# EAGLE schematic dlp.vco.dualosc.v1.0 (EAGLE 7.2.0)
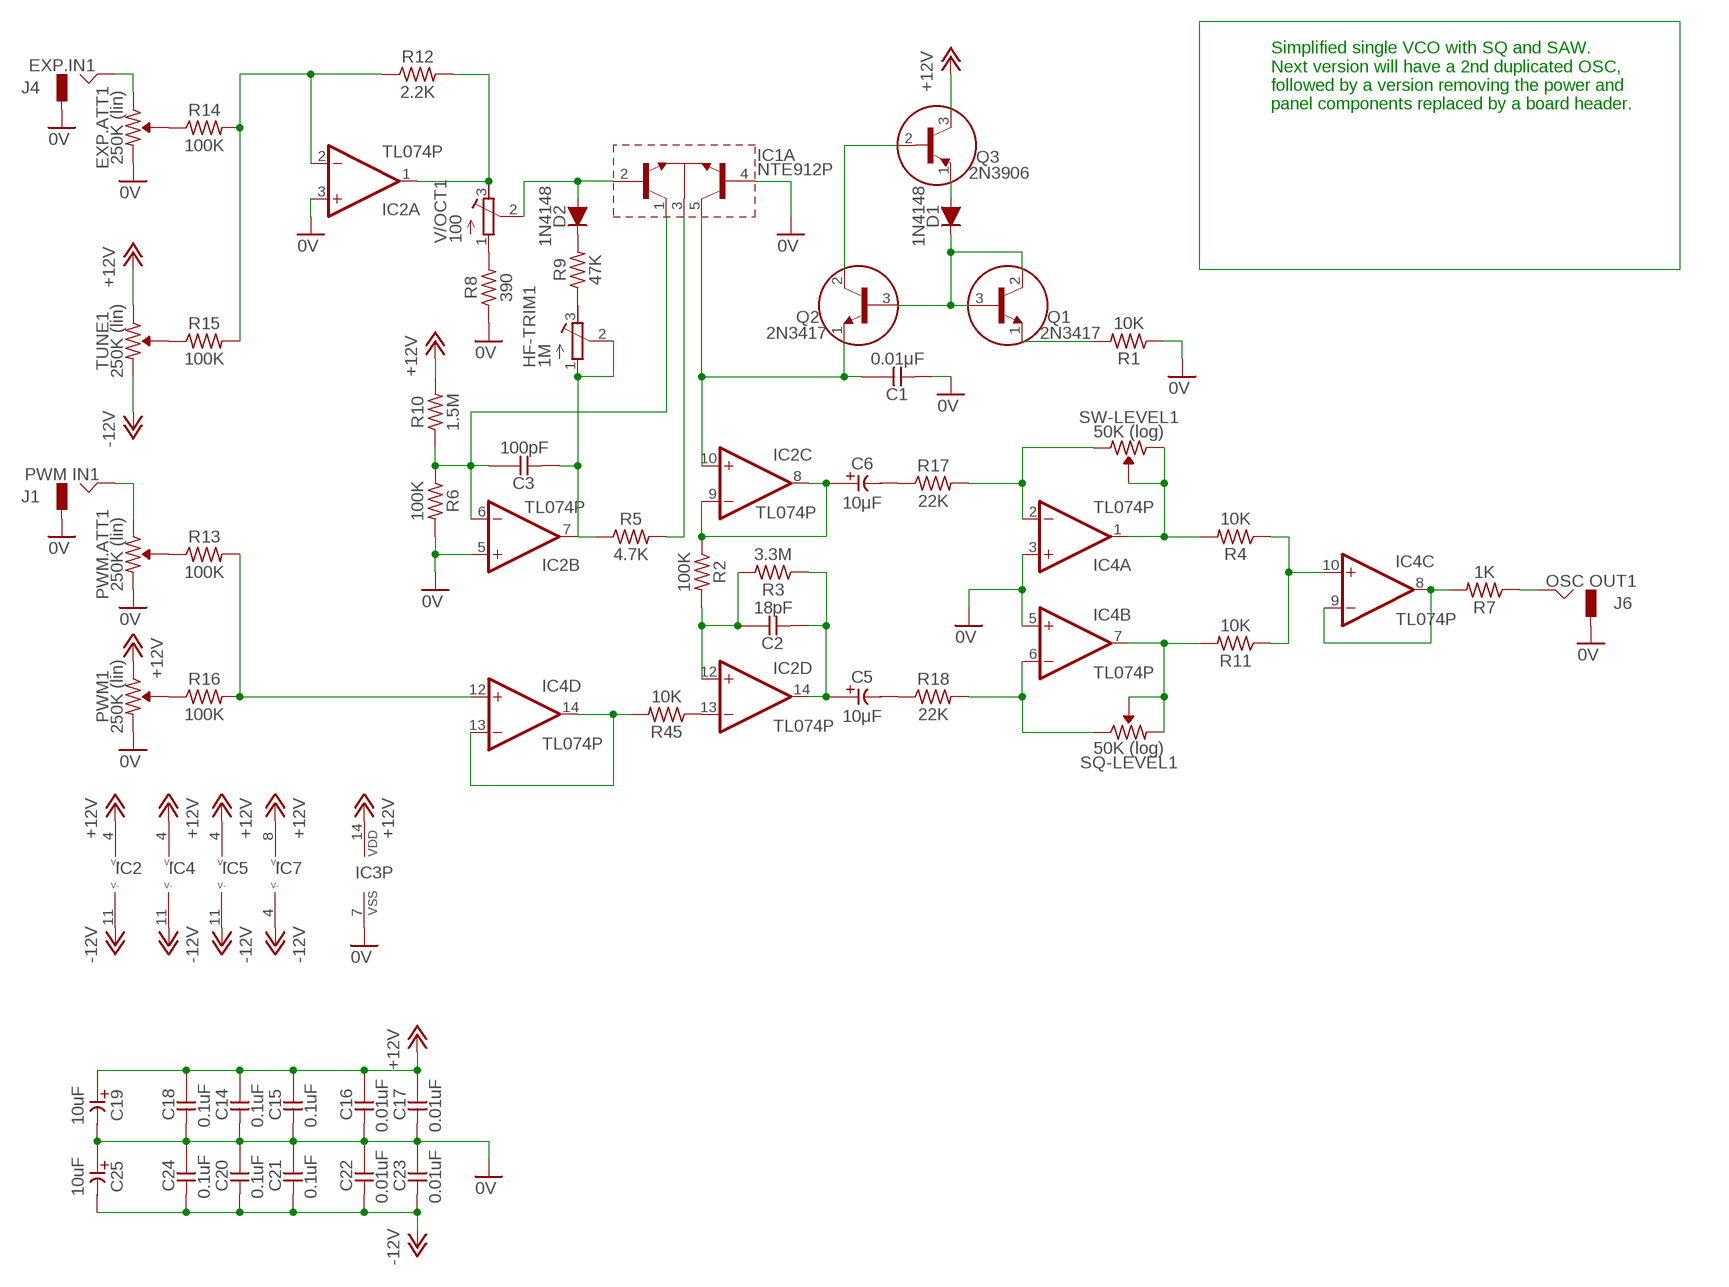
[diagram p0: schematic, sheet 1]

## Parts
C1  0.01μF  CC-US025-024X044  [C025-024X044]
C2  18pF  CC-US025-024X044  [C025-024X044]
C3  100pF  CC-US025-024X044  [C025-024X044]
C5  10μF  CE-USE2-5  [E2-5]
C6  10μF  CE-USE2-5  [E2-5]
C14  0.1uF  CC-US025-024X044  [C025-024X044]
C15  0.1uF  CC-US025-024X044  [C025-024X044]
C16  0.01uF  CC-US025-024X044  [C025-024X044]
C17  0.01uF  CC-US025-024X044  [C025-024X044]
C18  0.1uF  CC-US025-024X044  [C025-024X044]
C19  10uF  CE-USE2-5  [E2-5]
C20  0.1uF  CC-US025-024X044  [C025-024X044]
C21  0.1uF  CC-US025-024X044  [C025-024X044]
C22  0.01uF  CC-US025-024X044  [C025-024X044]
C23  0.01uF  CC-US025-024X044  [C025-024X044]
C24  0.1uF  CC-US025-024X044  [C025-024X044]
C25  10uF  CE-USE2-5  [E2-5]
D1  1N4148  [DO35-7]
D2  1N4148  [DO35-7]
EXP.ATT1  250K (lin)  R-VAR  [R-VAR]
HF-TRIM1  1M  R-TRIMM3296Y  [RTRIM3296Y]
IC1  NTE912P  [DIL14]
IC2  TL074P  [DIL14]
IC3  4013N  [DIL14]
IC4  TL074P  [DIL14]
IC5  TL074P  [DIL14]
IC7  TL072P  [DIL08]
J1  PWM IN1  JACK-M  [JACK-M]
J4  EXP.IN1  JACK-M  [JACK-M]
J6  OSC OUT1  JACK-M  [JACK-M]
PWM1  250K (lin)  R-VAR  [R-VAR]
PWM.ATT1  250K (lin)  R-VAR  [R-VAR]
Q1  2N3417  [TO92]
Q2  2N3417  [TO92]
Q3  2N3906  [TO92]
R1  10K  R0309/10  [0309/10]
R2  100K  R0309/10  [0309/10]
R3  3.3M  R0309/10  [0309/10]
R4  10K  R0309/10  [0309/10]
R5  4.7K  R0309/10  [0309/10]
R6  100K  R0309/10  [0309/10]
R7  1K  R0309/10  [0309/10]
R8  390  R0309/10  [0309/10]
R9  47K  R0309/10  [0309/10]
R10  1.5M  R0309/10  [0309/10]
R11  10K  R0309/10  [0309/10]
R12  2.2K  R0309/10  [0309/10]
R13  100K  R0309/10  [0309/10]
R14  100K  R0309/10  [0309/10]
R15  100K  R0309/10  [0309/10]
R16  100K  R0309/10  [0309/10]
R17  22K  R0309/10  [0309/10]
R18  22K  R0309/10  [0309/10]
R45  10K  R0309/10  [0309/10]
SQ-LEVEL1  50K (log)  R-VAR  [R-VAR]
SW-LEVEL1  50K (log)  R-VAR  [R-VAR]
TUNE1  250K (lin)  R-VAR  [R-VAR]
V/OCT1  100  R-TRIMM3296Y  [RTRIM3296Y]

## Nets
0V: C1.2 C14.2 C15.2 C16.2 C17.2 C18.2 C19.- C20.1 C21.1 C22.1 C23.1 C24.1 C25.+ EXP.ATT1.R2 IC1.4(A:B3) IC2.3(A:+IN) IC2.5(B:+IN) IC3.7(P:VSS) IC4.3(A:+IN) IC4.5(B:+IN) J1.GND J4.GND J6.GND PWM1.R2 PWM.ATT1.R2 R1.1 R6.2 R8.1
+12V: C14.1 C15.1 C16.1 C17.1 C18.1 C19.+ IC2.4(P:V+) IC3.14(P:VDD) IC4.4(P:V+) IC5.4(P:V+) IC7.8(P:V+) PWM1.R1 Q3.3(C) R10.2 TUNE1.R1
-12V: C20.2 C21.2 C22.2 C23.2 C24.2 C25.- IC2.11(P:V-) IC4.11(P:V-) IC5.11(P:V-) IC7.4(P:V-) TUNE1.R2
N$1: C1.1 IC1.5(A:C3) IC2.10(C:+IN) Q2.1(E)
N$2: Q2.2(C) Q3.2(B)
N$3: D1.A Q3.1(E)
N$4: C6.+ IC2.8(C:OUT) IC2.9(C:-IN) R2.1
N$5: D1.C Q1.2(C) Q1.3(B) Q2.3(B)
N$6: Q1.1(E) R1.2
N$7: C2.1 IC2.12(D:+IN) R2.2 R3.2
N$8: IC2.13(D:-IN) R45.1
N$9: C2.2 C5.+ IC2.14(D:OUT) R3.1
N$10: PWM.ATT1.VAR R13.1
N$11: D2.A IC1.2(A:B1) V/OCT1.2(S)
N$12: IC1.3(A:E) R5.2
N$13: D2.C R9.2
N$14: R8.2 V/OCT1.1(A)
N$15: C3.1 IC1.1(A:C1) IC2.6(B:-IN) R6.1 R10.1
N$16: IC2.1(A:OUT) R12.2 V/OCT1.3(E)
N$17: HF-TRIM1.3(E) R9.1
N$18: IC4.10(C:+IN) R4.1 R11.1
N$19: PWM1.VAR R16.1
N$20: IC4.8(C:OUT) IC4.9(C:-IN) R7.2
N$21: J6.HOT R7.1
N$22: IC4.2(A:-IN) R17.2 SW-LEVEL1.R2
N$23: EXP.ATT1.VAR R14.1
N$24: R15.1 TUNE1.VAR
N$25: J1.HOT PWM.ATT1.R1
N$26: EXP.ATT1.R1 J4.HOT
N$27: IC4.13(D:-IN) IC4.14(D:OUT) R45.2
N$28: IC2.2(A:-IN) R12.1 R14.2 R15.2
N$29: C6.- R17.1
N$30: C5.- R18.1
N$31: IC4.1(A:OUT) R4.2 SW-LEVEL1.R1 SW-LEVEL1.VAR
N$32: IC4.7(B:OUT) R11.2 SQ-LEVEL1.R2 SQ-LEVEL1.VAR
N$34: IC4.6(B:-IN) R18.2 SQ-LEVEL1.R1
N$35: IC4.12(D:+IN) R13.2 R16.2
N$37: C3.2 HF-TRIM1.1(A) HF-TRIM1.2(S) IC2.7(B:OUT) R5.1
Unconnected: IC1.6(B:B) IC1.7(B:E) IC1.8(B:C) IC1.9(C:B) IC1.10(C:E) IC1.11(C:C) IC1.12(D:B) IC1.13(D:E) IC1.14(D:C) IC3.1(A:Q) IC3.2(A:!Q) IC3.3(A:CLK) IC3.4(A:R) IC3.5(A:D) IC3.6(A:S) IC3.8(B:S) IC3.9(B:D) IC3.10(B:R) IC3.11(B:CLK) IC3.12(B:!Q) IC3.13(B:Q) IC5.1(A:OUT) IC5.2(A:-IN) IC5.3(A:+IN) IC5.5(B:+IN) IC5.6(B:-IN) IC5.7(B:OUT) IC5.8(C:OUT) IC5.9(C:-IN) IC5.10(C:+IN) IC5.12(D:+IN) IC5.13(D:-IN) IC5.14(D:OUT) IC7.1(A:OUT) IC7.2(A:-IN) IC7.3(A:+IN) IC7.5(B:+IN) IC7.6(B:-IN) IC7.7(B:OUT)

## Notes on the sheet
- Simplified single VCO with SQ and SAW.
  Next version will have a 2nd duplicated OSC,
  followed by a version removing the power and 
  panel components replaced by a board header.
- IC2 | IC4 | IC5 | IC7

## Library data of the parts
C1-C3 C14-C18 C20-C24 = _common:CC-US: CAPACITOR, US symbol
C5 C6 C19 C25 = _common:CE-US: ELECTROLYTIC CAPACITOR, US symbol
D1 D2 = _common:1N4148: DIODE high speed (Philips)
EXP.ATT1 PWM1 PWM.ATT1 SQ-LEVEL1 SW-LEVEL1 TUNE1 = _common:R-VAR
HF-TRIM1 V/OCT1 = rcl:R-TRIMM: Trimm resistor
IC1 = _common:NTE912: NPN TRANSISTOR ARRAY
IC2 IC4 IC5 = _common:TL074: OP AMP
IC3 = 40xx:4013: Dual D FLIP FLOP, set/reset
IC7 = _common:TL072: OP AMP
J1 J4 J6 = _common:JACK-M
Q1 Q2 = _common:2N3417: NPN Transistor
Q3 = _common:2N3906: PNP Transistor
R1-R18 R45 = _common:R: RESISTOR, US symbol